# EAGLE design oled_spi (EAGLE 6.5.0)
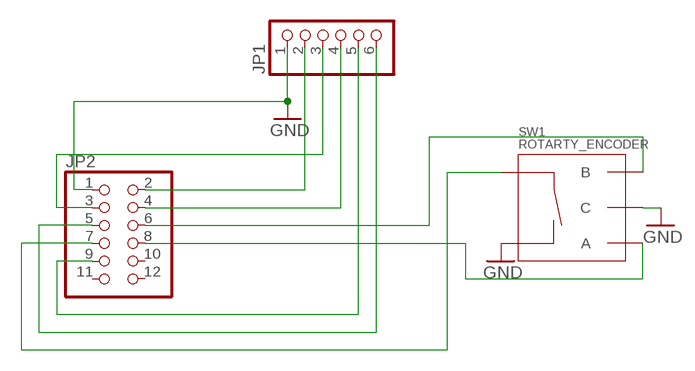
[diagram p0: schematic, sheet 1]

## Parts
JP1  PINHD-1X6  [1X06]
JP2  PINHD-2X6  [2X06]
SW1  ROTARTY_ENCODER  [ROTARY_ENC_PLAIN]

## Nets
GND: JP1.1 JP2.1 SW1.C SW1.SW-
N$1: JP2.7 SW1.SW+
N$2: JP1.2 JP2.2
N$3: JP1.3 JP2.3
N$4: JP1.4 JP2.4
N$5: JP1.5 JP2.9
N$6: JP2.6 SW1.B
N$7: JP2.8 SW1.A
N$9: JP1.6 JP2.5
Unconnected: JP2.10 JP2.11 JP2.12

## Library data of the parts
JP1 = pinhead:PINHD-1X6: PIN HEADER
JP2 = pinhead:PINHD-2X6: PIN HEADER
SW1 = SparkFun-Electromechanical:ROTARTY_ENCODER: Simple no LED rotary encoder Example: COM-09117

## Board
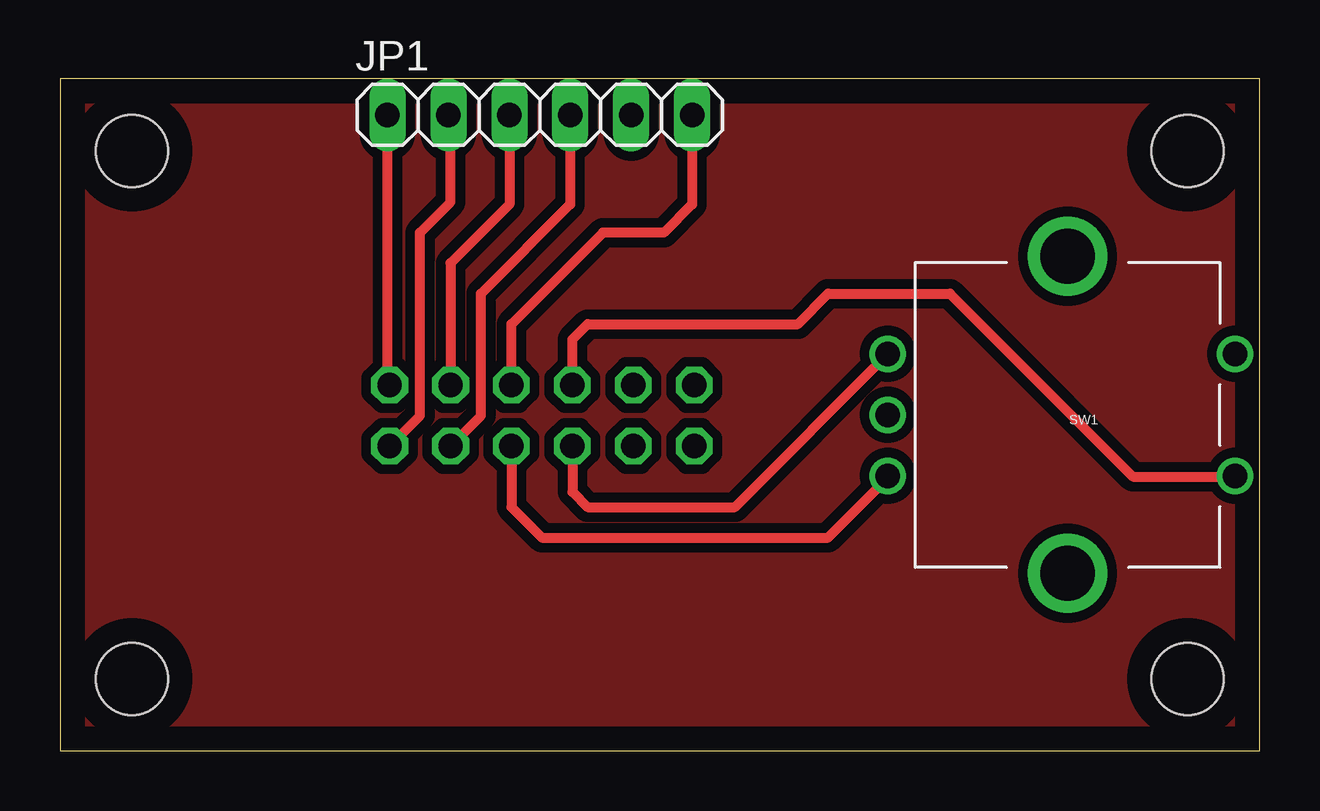
[diagram p1: board, top side]
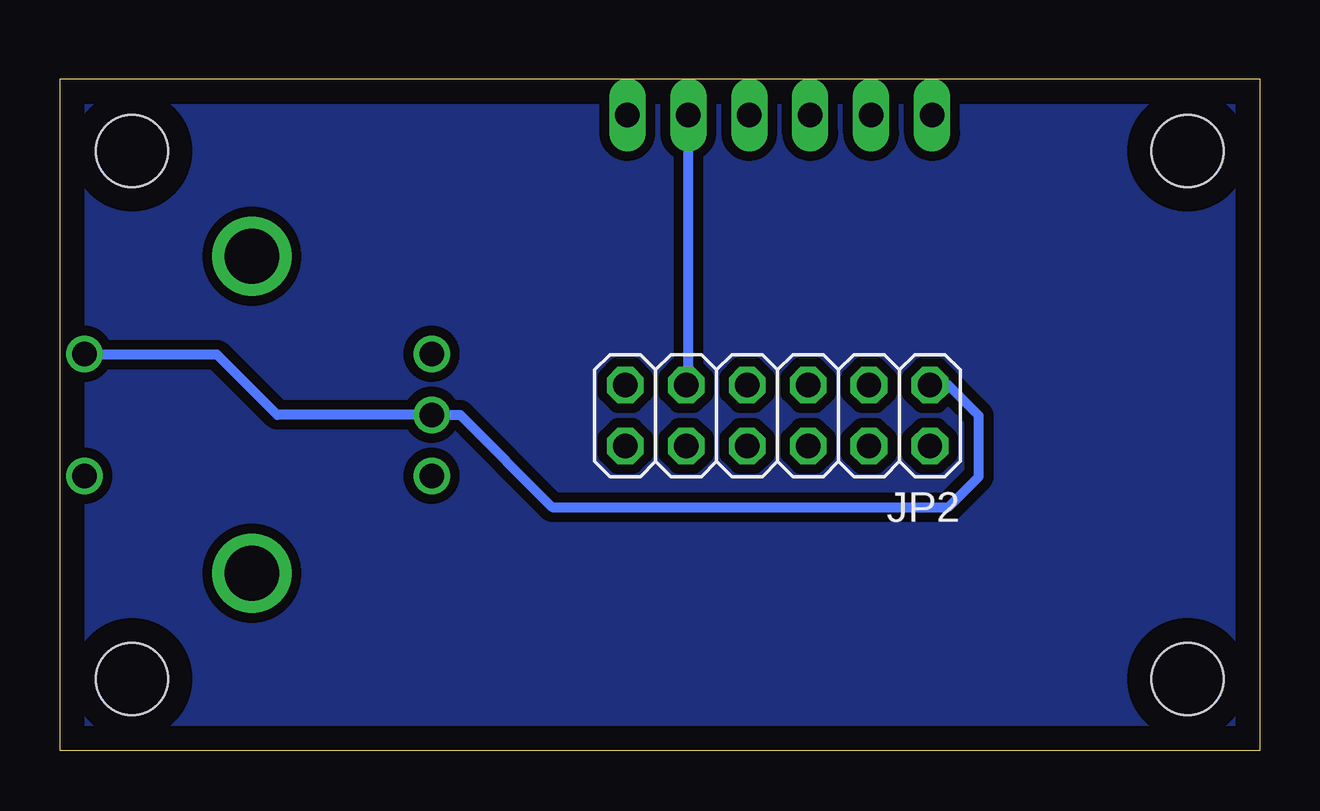
[diagram p2: board, bottom side, seen from below]

Size 50 x 28 mm. Coordinates in mm from the lower left corner, seen from the top.
Outline: 0,0 50,0 50,28 0,28 0,0
Copper layers (1*16): Top 0.035mm / dielectric 1.5mm / Bottom 0.035mm
Design rules "default": minimum track width 10mil, minimum drill 24mil, track to track 8mil, track to pad 8mil, pad to pad 8mil, via to via 8mil, smd to smd 8mil, copper to edge 40mil, drill to drill 8mil, minimum pad ring 10mil, minimum via ring 8mil, stop-mask expansion 4mil, vias tented up to drill 0mil, thermal gap 10mil
Holes 3 mm at 3,25 3,3 47,25 47,3

### Footprints (pad centres in the part's own frame; a part is rotated, then mirrored left to right if it is on the bottom)
1X06 = drill 1.016 long: 1 -6.35,0; 2 -3.81,0; 3 -1.27,0; 4 1.27,0; 5 3.81,0; 6 6.35,0
2X06 = drill 1.016 octagon: 1 -6.35,-1.27; 2 -6.35,1.27; 3 -3.81,-1.27; 4 -3.81,1.27; 5 -1.27,-1.27; 6 -1.27,1.27; 7 1.27,-1.27; 8 1.27,1.27; 9 3.81,-1.27; 10 3.81,1.27; 11 6.35,-1.27; 12 6.35,1.27
ROTARY_ENC_PLAIN = drill 1.016: A 7.493,-2.54; B 7.493,2.54; C 7.493,0; SW+ -6.985,2.54; SW- -6.985,-2.54 | drill 2.286: P$3 0,6.604; P$4 0,-6.604

### Placement (x,y rotation side)
JP1  20,26.5 0 top
JP2  20.09,13.97 180 bottom
SW1  42,14 180 top

### Tracks (layer width: path | path; a pad name or v marks a point on that pad's centre or on a via)
GND
  Top 0.406: JP2.1 13.65,15.24 JP1.1
  Bottom 0.406: JP2.1 12.97,15.24 11.7,13.97 11.7,11.43 12.97,10.16 29.48,10.16 33.32,14 SW1.C 40.94,14 43.45,16.51 48.95,16.51 SW1.SW-
N$1
  Top 0.406: JP2.7 21.36,17.14 22,17.78 30.75,17.78 32.02,19.05 37.1,19.05 44.72,11.43 48.95,11.43 SW1.SW+
N$2
  Top 0.406: JP2.2 15.01,13.97 15.01,21.59 16.28,22.86 16.28,26.41 JP1.2
N$3
  Top 0.406: JP1.3 18.73,22.77 16.28,20.32 JP2.3
N$4
  Top 0.406: JP2.4 17.55,13.97 17.55,19.05 21.27,22.77 JP1.4
N$5
  Bottom 0.406: JP2.9 23.81,15.24 JP1.5
N$6
  Top 0.406: JP2.6 18.82,10.16 20.09,8.89 32.02,8.89 34.56,11.43 34.48,11.43 SW1.B
N$7
  Top 0.406: JP2.8 21.36,10.79 22,10.16 28.13,10.16 SW1.A
N$9
  Top 0.406: JP2.5 18.82,17.78 22.63,21.59 25.17,21.59 26.35,22.77 JP1.6
N$13
  pour Top (isolate 0.406): 1,27 49,27 49,1 1,1
N$14
  pour Bottom (isolate 0.406): 1,27 49,27 49,1 1,1

### Text on the board
tOrigins: Gnd | Vcc | TinyBoy2 / OLED Controller